# EAGLE design RGBKeyboard (EAGLE 9.3.0)

## Sheet 1 of 2
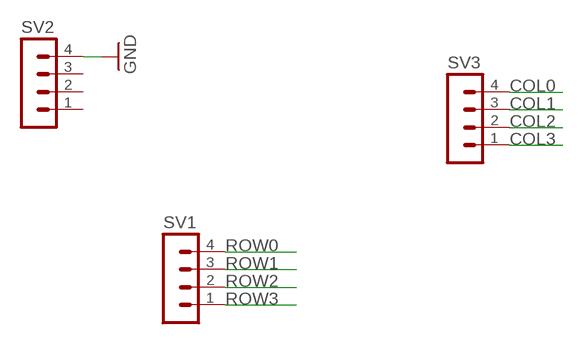
[diagram p0: schematic, sheet 1]

### Parts
SV1  MA04-1  [MA04-1]
SV2  MA04-1  [MA04-1]
SV3  MA04-1  [MA04-1]

### Nets
COL0: SV3.4 ; also sheet 2
COL1: SV3.3 ; also sheet 2
COL2: SV3.2 ; also sheet 2
COL3: SV3.1 ; also sheet 2
GND: SV2.4 ; also sheet 2
ROW0: SV1.4 ; also sheet 2
ROW1: SV1.3 ; also sheet 2
ROW2: SV1.2 ; also sheet 2
ROW3: SV1.1 ; also sheet 2
Unconnected: SV2.1 SV2.2 SV2.3

## Sheet 2 of 2
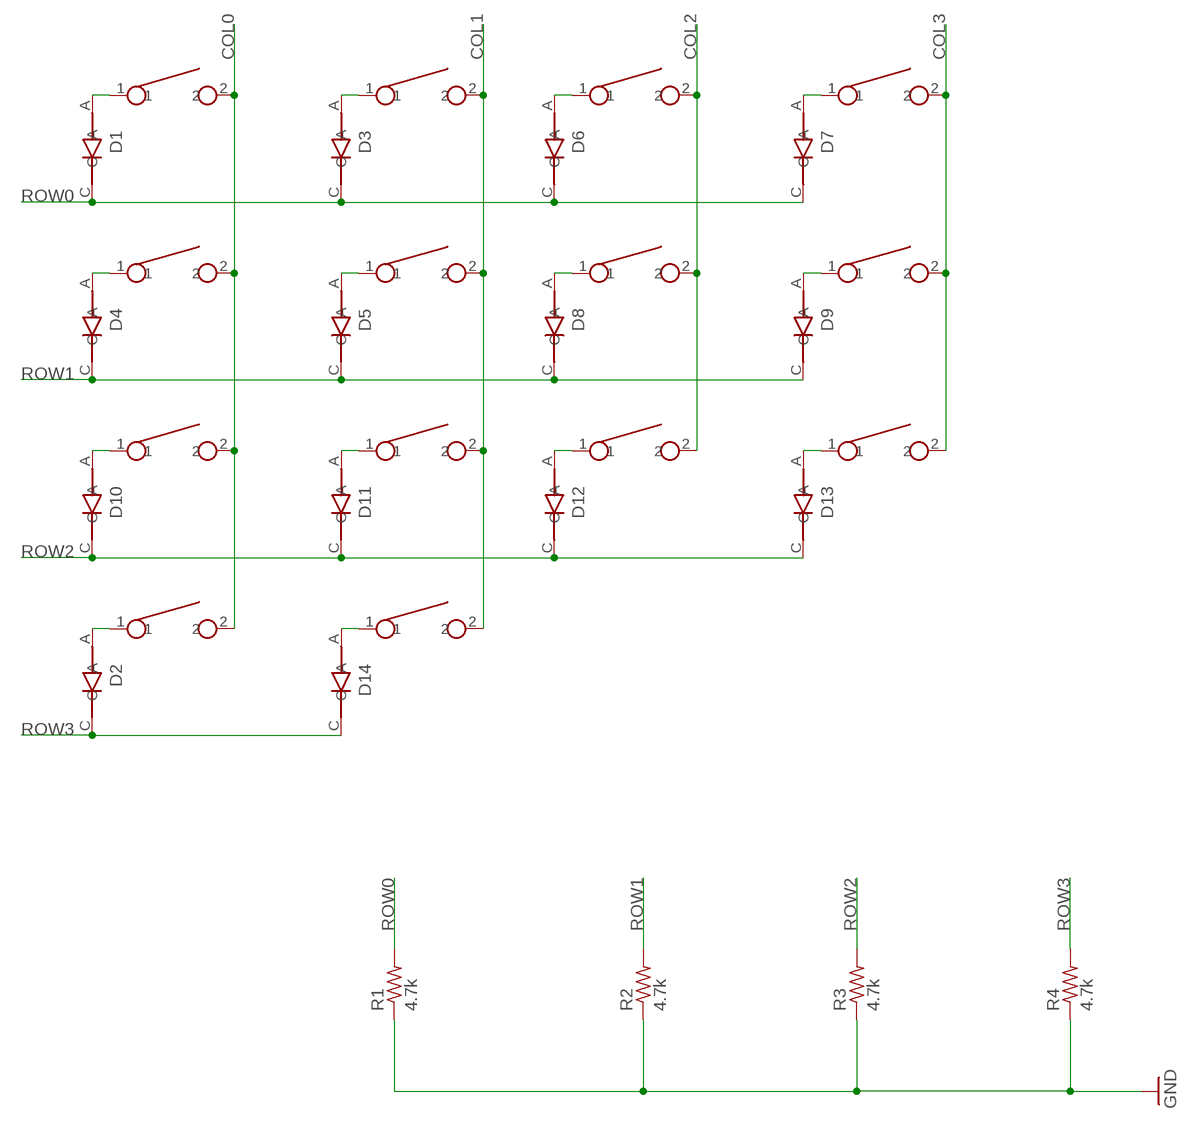
[diagram p1: schematic, sheet 2]

### Parts
D1  BAV21W-7-F  [SOD3715X135N]
D2  BAV21W-7-F  [SOD3715X135N]
D3  BAV21W-7-F  [SOD3715X135N]
D4  BAV21W-7-F  [SOD3715X135N]
D5  BAV21W-7-F  [SOD3715X135N]
D6  BAV21W-7-F  [SOD3715X135N]
D7  BAV21W-7-F  [SOD3715X135N]
D8  BAV21W-7-F  [SOD3715X135N]
D9  BAV21W-7-F  [SOD3715X135N]
D10  BAV21W-7-F  [SOD3715X135N]
D11  BAV21W-7-F  [SOD3715X135N]
D12  BAV21W-7-F  [SOD3715X135N]
D13  BAV21W-7-F  [SOD3715X135N]
D14  BAV21W-7-F  [SOD3715X135N]
R1  4.7k  R-US_R0603  [R0603]
R2  4.7k  R-US_R0603  [R0603]
R3  4.7k  R-US_R0603  [R0603]
R4  4.7k  R-US_R0603  [R0603]
U$1  CHERRY_MX  [CHERRY_MX]
U$2  CHERRY_MX  [CHERRY_MX]
U$3  CHERRY_MX  [CHERRY_MX]
U$4  CHERRY_MX  [CHERRY_MX]
U$5  CHERRY_MX  [CHERRY_MX]
U$6  CHERRY_MX  [CHERRY_MX]
U$7  CHERRY_MX  [CHERRY_MX]
U$8  CHERRY_MX  [CHERRY_MX]
U$9  CHERRY_MX  [CHERRY_MX]
U$10  CHERRY_MX  [CHERRY_MX]
U$11  CHERRY_MX  [CHERRY_MX]
U$12  CHERRY_MX  [CHERRY_MX]
U$13  CHERRY_MXCHERRY_MX_1_2  [CHERRY_MX_1_2]
U$14  CHERRY_MXCHERRY_MX_1_2  [CHERRY_MX_1_2]

### Nets
COL0: U$1.2 U$2.2 U$3.2 U$13.2 ; also sheet 1
COL1: U$4.2 U$5.2 U$6.2 U$14.2 ; also sheet 1
COL2: U$7.2 U$8.2 U$9.2 ; also sheet 1
COL3: U$10.2 U$11.2 U$12.2 ; also sheet 1
GND: R1.1 R2.1 R3.1 R4.1 ; also sheet 1
N$1: D9.A U$10.1
N$2: D5.A U$5.1
N$3: D7.A U$12.1
N$4: D2.A U$13.1
N$5: D14.A U$14.1
N$6: D3.A U$4.1
N$11: D11.A U$6.1
N$12: D13.A U$11.1
N$33: D6.A U$7.1
N$35: D8.A U$8.1
N$36: D12.A U$9.1
N$37: D10.A U$3.1
N$38: D1.A U$1.1
N$39: D4.A U$2.1
ROW0: D1.C D3.C D6.C D7.C R1.2 ; also sheet 1
ROW1: D4.C D5.C D8.C D9.C R2.2 ; also sheet 1
ROW2: D10.C D11.C D12.C D13.C R3.2 ; also sheet 1
ROW3: D2.C D14.C R4.2 ; also sheet 1

## Library data of the parts
D1-D14 = BAV21W-7-F:BAV21W-7-F: SURFACE MOUNT SWITCHING DIODE; DESCRIPTION: DIODE, SWITCH, 200V, 0.25W, SOD123; Diode Type: Switching; Forward Current If_AV_; DIGI-KEY_PART_NUMBER: BAV21W-FDICT-ND; DIGI-KEY_PURCHASE_URL: https://www.digikey.com/product-detail/en/diodes-incorporated/BAV21W-7-F/BAV21W-FDICT-ND/717830?utm_source=snapeda&utm_medium=aggregator&utm_campaign=symbol; MF: Diodes Inc.; MP: BAV21W-7-F; PACKAGE: SOD-123 Diodes Inc.
R1-R4 = rcl:R-US_: RESISTOR, American symbol; SPICEPREFIX: R
SV1-SV3 = con-lstb:MA04-1: PIN HEADER; OC_FARNELL: unknown; OC_NEWARK: unknown
U$1-U$14 = CHERRY_MX:CHERRY_MX

## Net classes
0 default: width 0.305 mm

## Board
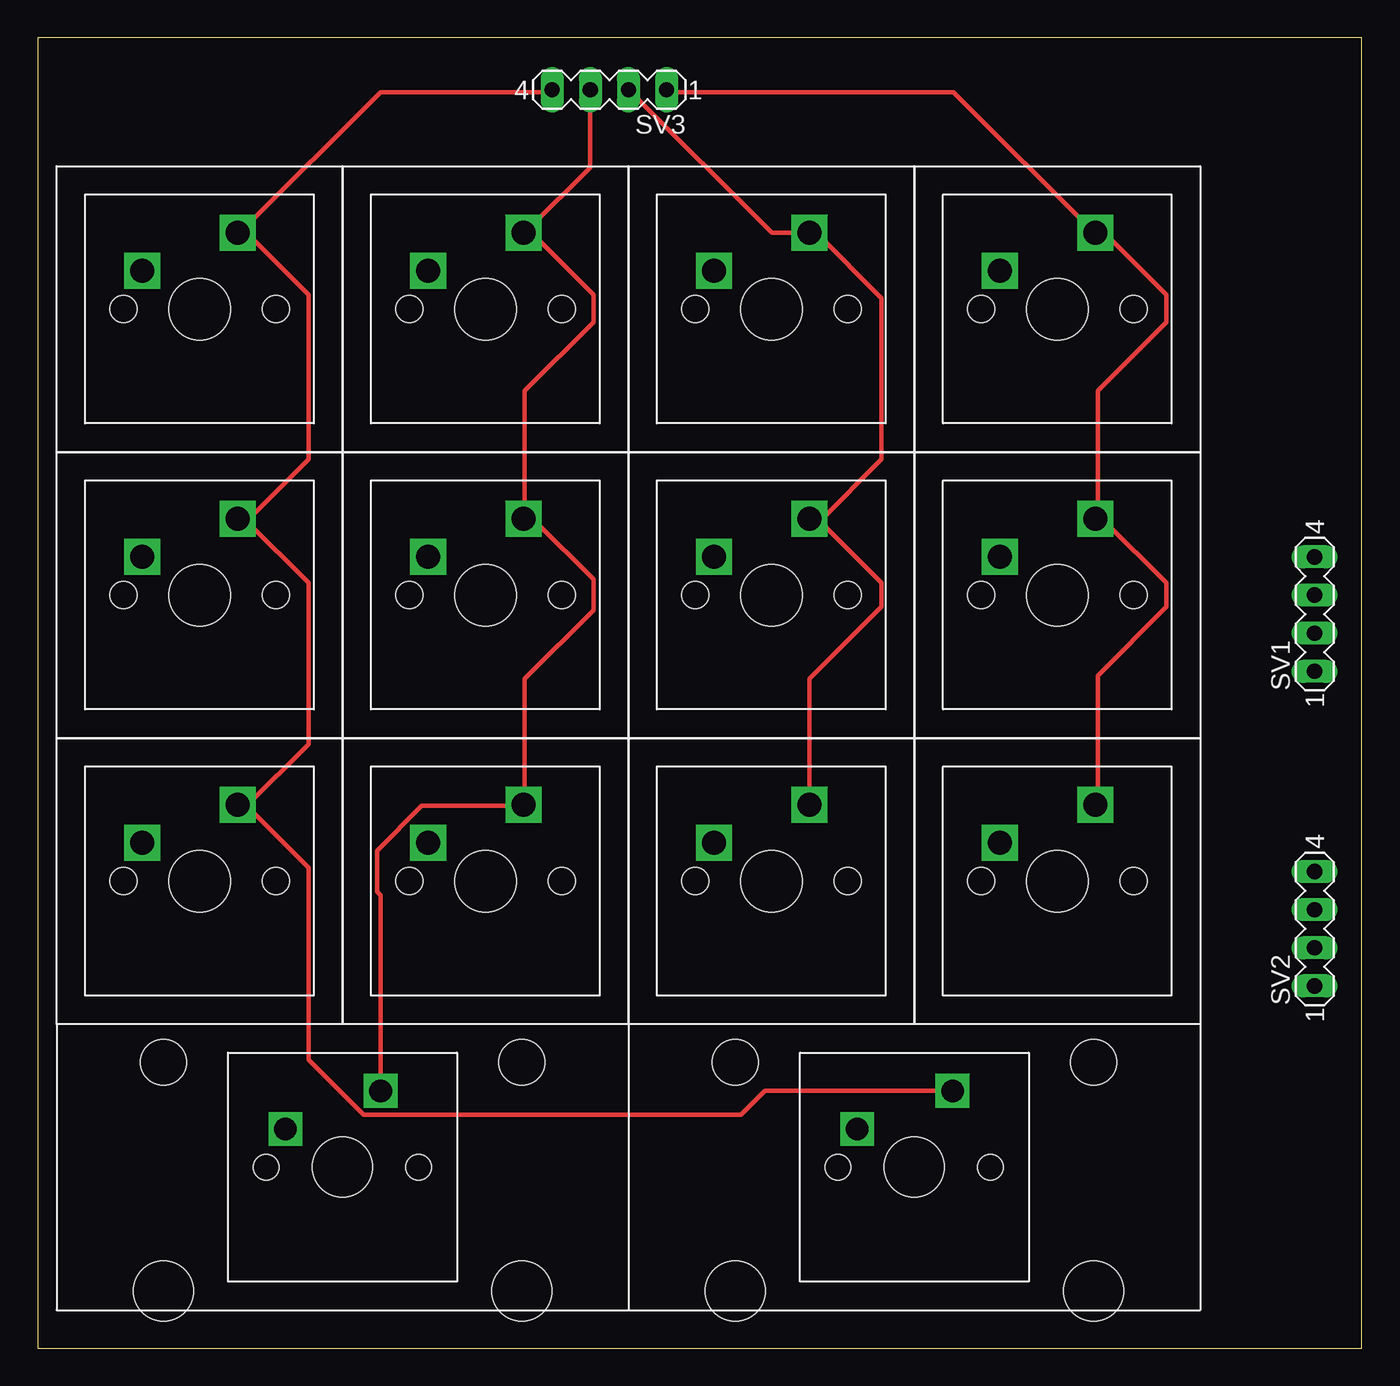
[diagram p2: board, top side]
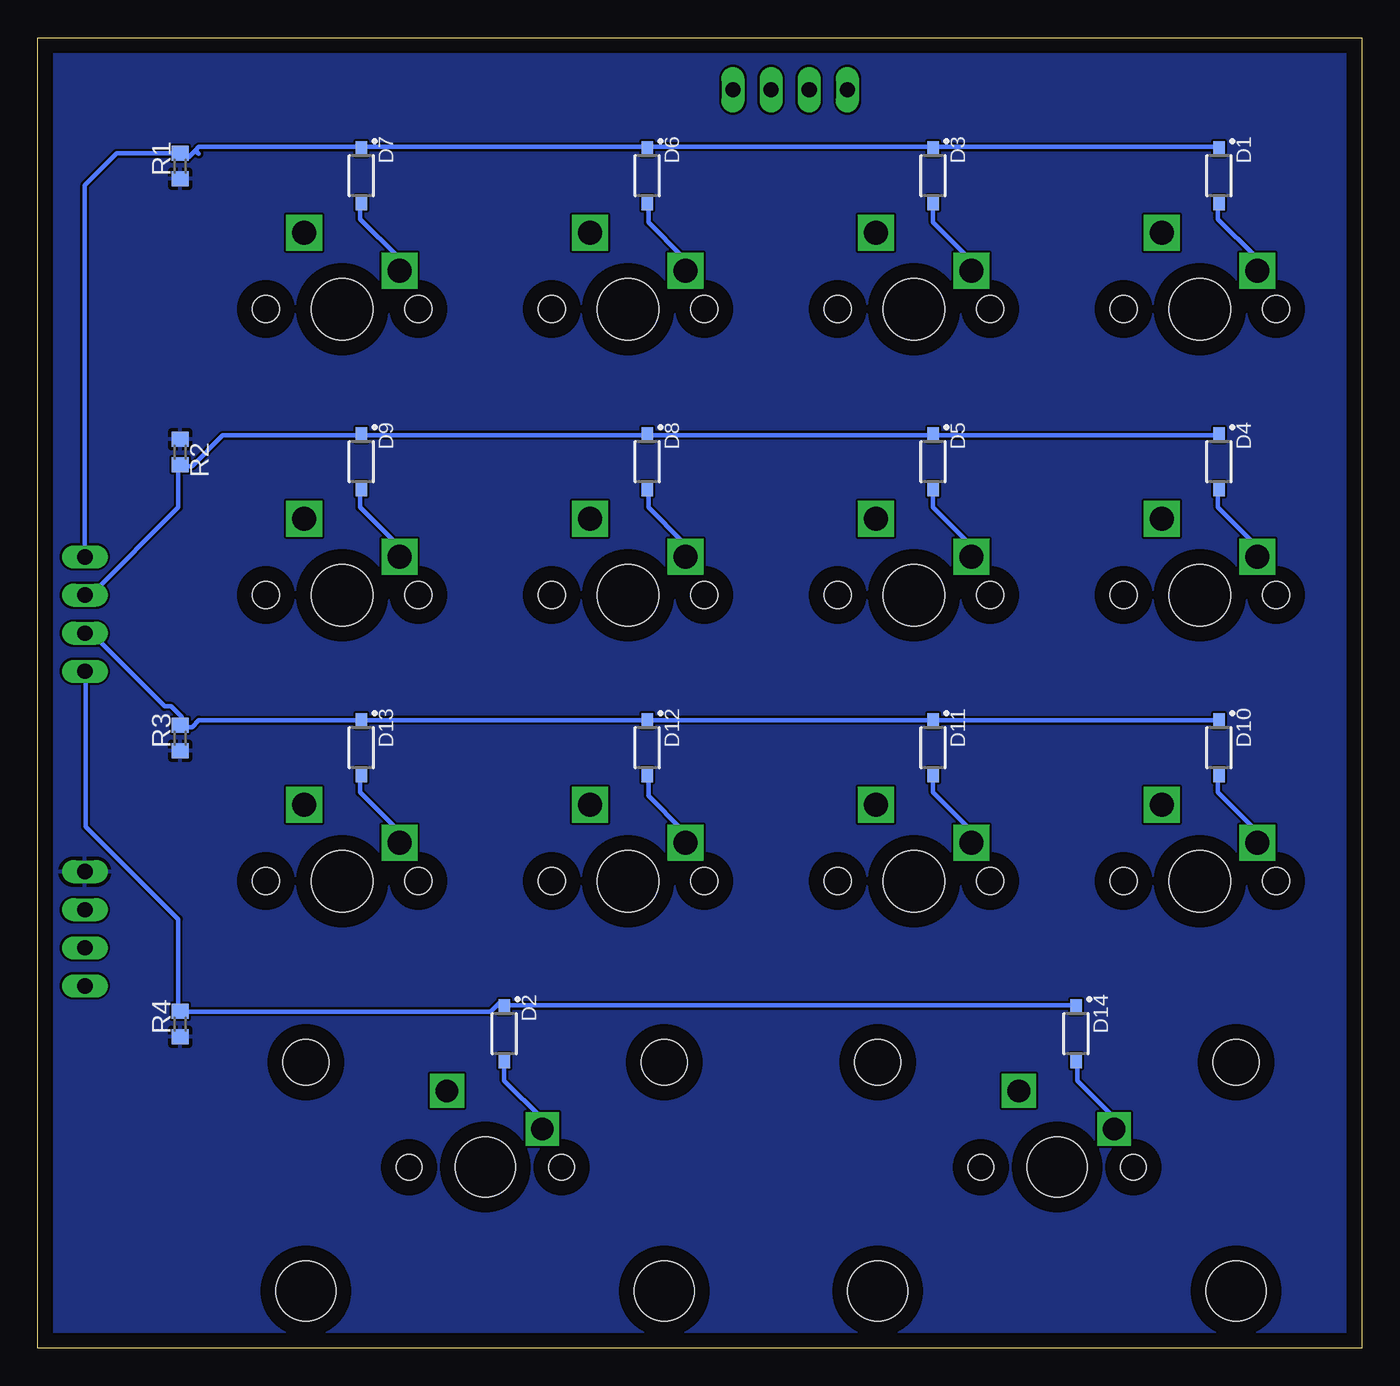
[diagram p3: board, bottom side, seen from below]

Size 88.25 x 87.3 mm. Coordinates in mm from the lower left corner, seen from the top.
Outline: 0,0 88.25,0 88.25,87.3 0,87.3 0,0
Copper layers (1*16): Top 0.035mm / dielectric 1.5mm / Bottom 0.035mm
Design rules "default": minimum track width 6mil, minimum drill 0.35mm, track to track 6mil, track to pad 6mil, pad to pad 6mil, via to via 6mil, smd to smd 6mil, copper to edge 40mil, drill to drill 6mil, minimum pad ring 10mil, minimum via ring 8mil, stop-mask expansion 4mil, vias tented up to drill 0mil, thermal gap 10mil

### Footprints (pad centres in the part's own frame; a part is rotated, then mirrored left to right if it is on the bottom)
SOD3715X135N = smd 1 x 0.75: A 1.8,0; C -1.8,0
R0603 = smd 1 x 1.1: 1 -0.85,0; 2 0.85,0
MA04-1 = drill 1.016 long: 1 -3.81,0; 2 -1.27,0; 3 1.27,0; 4 3.81,0
CHERRY_MX = drill 1.6 square: 1 -3.81,2.54; 2 2.54,5.08 | hole 4.1: 0,0 | hole 1.8: -5.08,0; 5.08,0
CHERRY_MX_1_2 = drill 1.5 square: 1 -3.81,2.54; 2 2.54,5.08 | hole 4: 0,0; -11.938,-8.255; 11.938,-8.255 | hole 1.7: -5.08,0; 5.08,0 | hole 3.05: -11.938,6.985; 11.938,6.985

### Placement (x,y rotation side)
D1  9.53,78.11 270 bottom
D2  57.15,20.95 270 bottom
D3  28.57,78.11 270 bottom
D4  9.53,59.05 270 bottom
D5  28.57,59.05 270 bottom
D6  47.62,78.11 270 bottom
D7  66.67,78.11 270 bottom
D8  47.62,59.05 270 bottom
D9  66.67,59.05 270 bottom
D10  9.53,40.01 270 bottom
D11  28.57,40.01 270 bottom
D12  47.62,40.01 270 bottom
D13  66.67,40.01 270 bottom
D14  19.05,20.95 270 bottom
R1  78.74,78.74 90 bottom
R2  78.74,59.69 270 bottom
R3  78.74,40.64 90 bottom
R4  78.74,21.59 90 bottom
SV1  85.09,48.9 90 top
SV2  85.09,27.94 90 top
SV3  38.1,83.82 180 top
U$1  10.79,69.22 0 top
U$2  10.79,50.16 0 top
U$3  10.79,31.11 0 top
U$4  29.84,69.22 0 top
U$5  29.84,50.16 0 top
U$6  29.84,31.11 0 top
U$7  48.9,69.22 0 top
U$8  48.9,50.16 0 top
U$9  48.9,31.11 0 top
U$10  67.94,50.16 0 top
U$11  67.94,31.11 0 top
U$12  67.94,69.22 0 top
U$13  58.42,12.06 0 top
U$14  20.32,12.06 0 top

### Tracks (layer width: path | path; a pad name or v marks a point on that pad's centre or on a via)
COL0
  Top 0.305: 13.72,74.52 13.49,74.3 U$1.2 13.72,74.52 | 13.72,74.52 22.86,83.67 34.29,83.67 SV3.4 | U$13.2 48.46,17.14 46.86,15.54 21.72,15.54 18.06,19.2 18.06,32 13.95,36.12 | 13.95,36.12 13.49,36.12 U$3.2 13.95,36.12 | 13.95,55.09 13.49,55.09 U$2.2 13.95,55.09 | 13.95,55.09 18.06,50.98 18.06,40.23 13.95,36.12 | 13.72,74.52 18.06,70.18 18.06,59.21 13.95,55.09
COL1
  Top 0.305: U$14.2 22.86,30.18 22.63,30.4 22.63,33.15 25.6,36.12 32.23,36.12 U$6.2 32.46,36.35 32.46,44.58 37.03,49.15 37.03,51.21 33.15,55.09 32.46,55.09 U$5.2 32.46,55.32 32.46,63.78 37.03,68.35 37.03,70.18 32.69,74.52 | 32.69,74.52 32.46,74.3 U$4.2 32.69,74.52 | 32.69,74.52 36.8,78.64 36.8,83.67 SV3.3
COL2
  Top 0.305: SV3.2 39.55,83.67 48.92,74.3 U$7.2 51.89,74.3 56.24,69.95 56.24,59.21 52.12,55.09 | U$9.2 51.44,44.58 56.24,49.38 56.24,50.98 52.12,55.09 | 52.12,55.09 51.44,55.09 U$8.2 52.12,55.09
COL3
  Top 0.305: U$11.2 70.64,36.35 70.64,44.81 75.21,49.38 75.21,50.98 71.09,55.09 70.64,55.09 U$10.2 70.64,55.32 70.64,63.78 75.21,68.35 75.21,70.18 71.09,74.3 U$12.2 70.41,74.3 61.04,83.67 42.06,83.67 SV3.1
GND
  pour Bottom: -0.64,88.27 -0.64,-0.64 88.9,-0.64 88.9,88.27
N$1
  Bottom 0.305: D9.A 66.75,57.15 66.75,56.01 64.24,53.49 64.24,52.81 U$10.1
N$2
  Bottom 0.305: D5.A 28.57,56.01 26.06,53.49 26.06,52.81 U$5.1
N$3
  Bottom 0.305: D7.A 66.75,76.12 66.75,75.21 64.24,72.69 64.24,71.78 U$12.1
N$4
  Bottom 0.305: D2.A 57.15,17.83 54.63,15.32 54.63,14.63 U$13.1
N$5
  Bottom 0.305: D14.A 18.97,18.97 18.97,17.83 16.69,15.54 16.69,14.63 U$14.1
N$6
  Bottom 0.305: D3.A 28.57,74.98 26.06,72.47 26.06,71.78 U$4.1
N$11
  Bottom 0.305: D11.A 28.57,37.03 26.06,34.52 26.06,33.83 U$6.1
N$12
  Bottom 0.305: D13.A 66.75,38.18 66.75,37.03 64.24,34.52 64.24,33.83 U$11.1
N$33
  Bottom 0.305: D6.A 47.55,76.12 47.55,74.98 45.26,72.69 45.26,71.78 U$7.1
N$35
  Bottom 0.305: D8.A 47.55,57.15 47.55,56.01 45.26,53.72 45.26,52.81 U$8.1
N$36
  Bottom 0.305: D12.A 47.55,38.18 47.55,36.8 45.26,34.52 45.26,33.83 U$9.1
N$37
  Bottom 0.305: D10.A 9.6,38.18 9.6,37.03 7.09,34.52 7.09,33.83 U$3.1
N$38
  Bottom 0.305: D1.A 9.6,76.12 9.6,75.21 7.09,72.69 7.09,71.78 U$1.1
N$39
  Bottom 0.305: D4.A 9.6,57.15 9.6,56.01 7.09,53.49 7.09,52.81 U$2.1
ROW0
  Top 0.305: 85.04,52.81 SV1.4
  Bottom 0.305: 28.57,80.01 9.6,80.01 D1.C | 28.57,80.01 47.55,80.01 D6.C 47.78,80.01 66.52,80.01 D7.C 66.75,80.01 77.5,80.01 77.72,79.78 | 28.57,80.01 D3.C | 77.72,79.78 78.18,79.32 78.41,79.32 78.64,79.55 R1.2 82.97,79.59 85.09,77.47 SV1.4 | 77.72,79.78 77.5,79.55
ROW1
  Bottom 0.305: SV1.3 85.04,50.29 84.58,50.29 78.87,56.01 78.87,58.75 R2.2 78.64,58.75 77.95,58.75 75.89,60.81 66.75,60.81 D9.C 66.52,60.81 47.78,60.81 D8.C 47.55,60.81 28.57,60.81 | 28.57,60.81 9.6,60.81 D4.C | 28.57,60.81 D5.C
ROW2
  Bottom 0.305: SV1.2 85.04,47.55 84.58,47.55 79.78,42.75 79.32,42.75 78.64,42.06 78.64,41.6 R3.2 78.64,41.38 77.95,41.38 77.5,41.83 66.75,41.83 D13.C 66.52,41.83 47.78,41.83 D12.C 47.55,41.83 28.57,41.83 | 28.57,41.83 9.6,41.83 D10.C | 28.57,41.83 D11.C
ROW3
  Bottom 0.305: 56.92,22.86 57.15,22.86 D2.C 56.92,22.86 | 56.92,22.86 19.2,22.86 D14.C | 56.92,22.86 57.15,23.09 57.38,23.09 58.06,22.4 78.64,22.4 R4.2 78.87,22.63 78.87,28.57 85.04,34.75 85.04,45.03 SV1.1